# EAGLE design GunMainBoard (EAGLE 8.6.0)
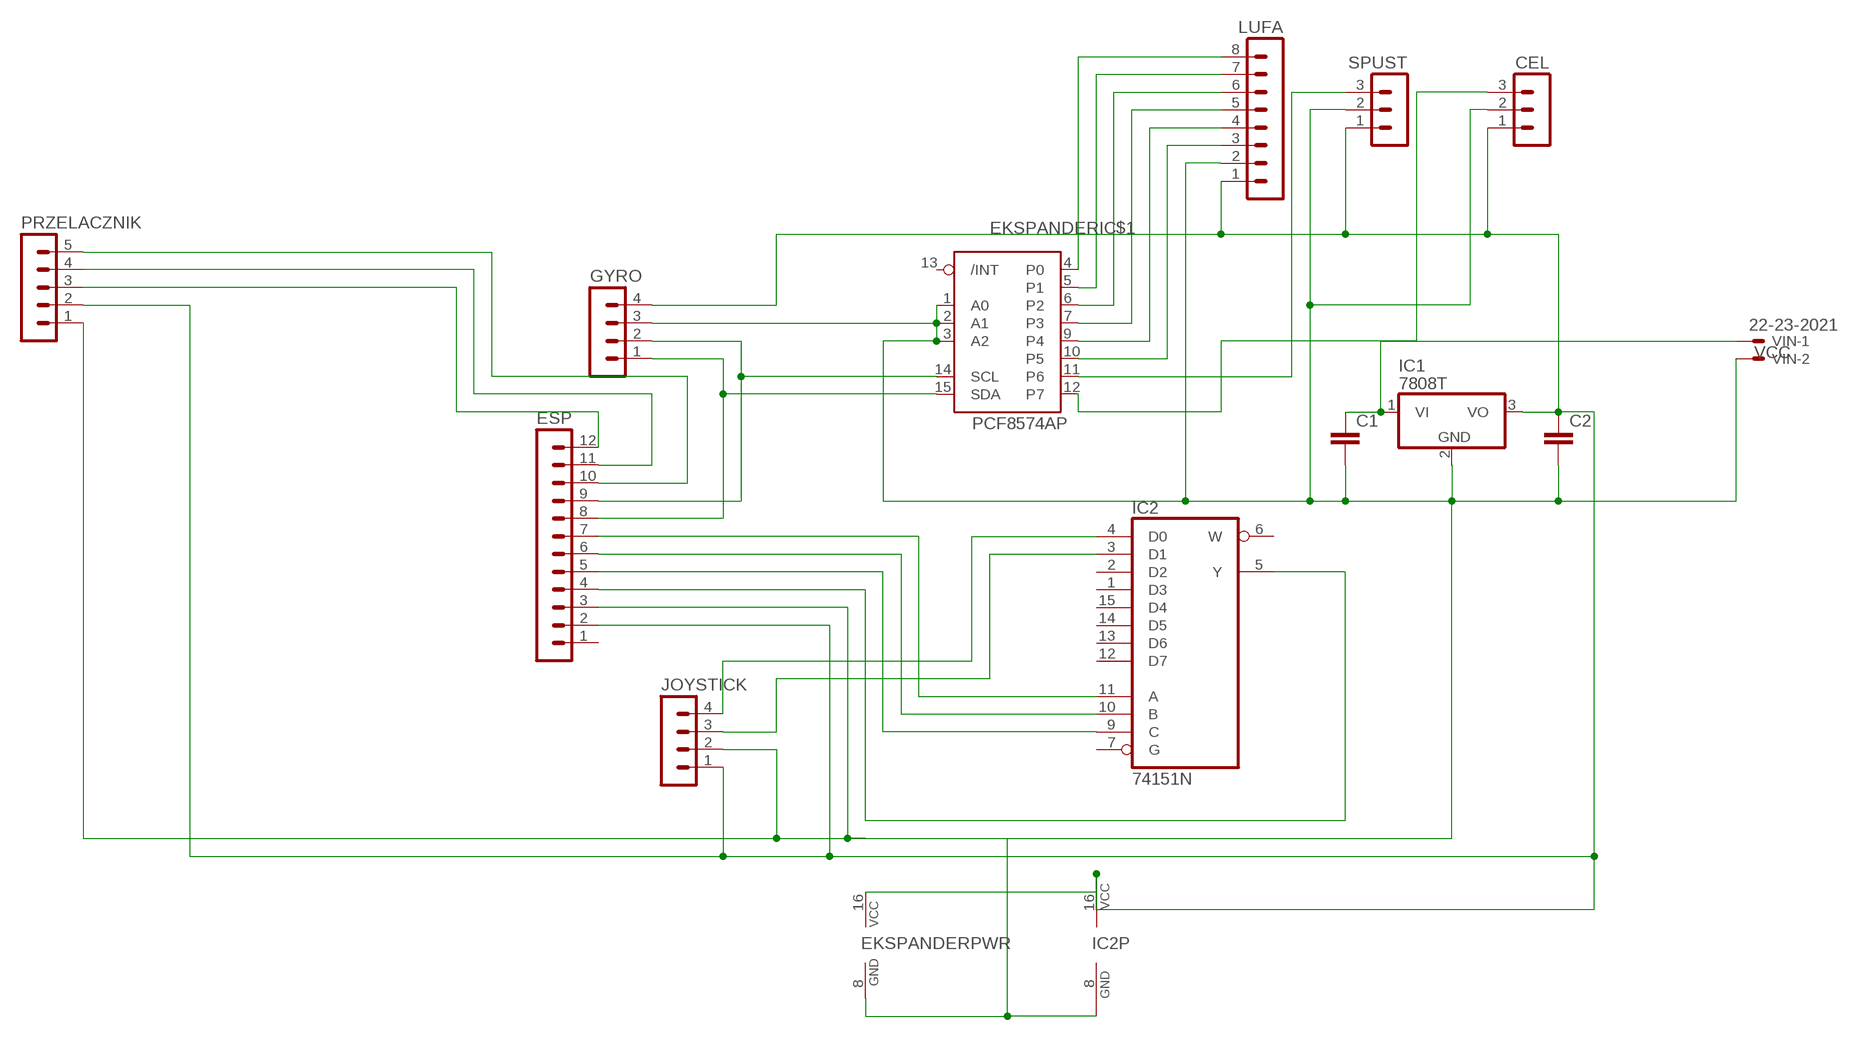
[diagram p0: schematic, sheet 1]

## Parts
C1  C-EU025-024X044  [C025-024X044]
C2  C-EU025-024X044  [C025-024X044]
CEL  MA03-1  [MA03-1]
EKSPANDER  PCF8574AP  [DIL16]
ESP  MA12-1  [MA12-1]
GYRO  MA04-1  [MA04-1]
IC1  7808T  [TO220H]
IC2  74151N  [DIL16]
JOYSTICK  MA04-1  [MA04-1]
LUFA  MA08-1  [MA08-1]
PRZELACZNIK  MA05-1  [MA05-1]
SPUST  MA03-1  [MA03-1]
VIN  22-23-2021  [22-23-2021]

## Nets
N$1: ESP.10 PRZELACZNIK.5
N$3: EKSPANDER.15(IC$1:SDA) ESP.8 GYRO.1
N$4: EKSPANDER.4(IC$1:P0) LUFA.8
N$5: ESP.7 IC2.11(A)
N$6: EKSPANDER.14(IC$1:SCL) ESP.9 GYRO.2
N$7: ESP.6 IC2.10(B)
N$8: ESP.5 IC2.9(C)
N$9: ESP.4 IC2.5(Y)
N$10: C1.2 C2.2 CEL.2 EKSPANDER.1(IC$1:A0) EKSPANDER.2(IC$1:A1) EKSPANDER.3(IC$1:A2) EKSPANDER.8(PWR:GND) ESP.3 GYRO.3 IC1.2(GND) IC2.8(GND) JOYSTICK.2 LUFA.2 PRZELACZNIK.1 SPUST.2 VIN.2
N$11: EKSPANDER.5(IC$1:P1) LUFA.7
N$12: EKSPANDER.6(IC$1:P2) LUFA.6
N$13: EKSPANDER.7(IC$1:P3) LUFA.5
N$14: EKSPANDER.9(IC$1:P4) LUFA.4
N$15: EKSPANDER.10(IC$1:P5) LUFA.3
N$16: EKSPANDER.11(IC$1:P6) SPUST.3
N$17: C1.1 IC1.1(VI) VIN.1
N$18: IC2.3(D1) JOYSTICK.3
N$19: CEL.3 EKSPANDER.12(IC$1:P7)
N$20: IC2.4(D0) JOYSTICK.4
N$21: ESP.11 PRZELACZNIK.4
N$22: ESP.12 PRZELACZNIK.3
N$25: C2.1 CEL.1 EKSPANDER.16(PWR:VCC) ESP.2 GYRO.4 IC1.3(VO) IC2.16(VCC) JOYSTICK.1 LUFA.1 PRZELACZNIK.2 SPUST.1
Unconnected: EKSPANDER.13(IC$1:/INT) ESP.1 IC2.1(D3) IC2.2(D2) IC2.6(W) IC2.7(G) IC2.12(D7) IC2.13(D6) IC2.14(D5) IC2.15(D4)

## Library data of the parts
C1 C2 = rcl:C-EU: CAPACITOR, European symbol; SPICEPREFIX: C
CEL SPUST = con-lstb:MA03-1: PIN HEADER; OC_FARNELL: unknown; OC_NEWARK: unknown
EKSPANDER = i2c:PCF8574: Remote 8-Bit I/O Expander for I²C Bus
ESP = con-lstb:MA12-1: PIN HEADER; OC_FARNELL: unknown; OC_NEWARK: unknown
GYRO JOYSTICK = con-lstb:MA04-1: PIN HEADER; OC_FARNELL: unknown; OC_NEWARK: unknown
IC1 = linear:78*: Positive VOLTAGE REGULATOR Source: http://cache.national.com/ds/LM/LM78L05.pdf http://www.fairchildsemi.com/ds/LM/LM7805.pdf
IC2 = 74xx-us:74*151: Data SELECTOR/MULTIPLEXER
LUFA = con-lstb:MA08-1: PIN HEADER; OC_FARNELL: unknown; OC_NEWARK: unknown
PRZELACZNIK = con-lstb:MA05-1: PIN HEADER; OC_FARNELL: unknown; OC_NEWARK: unknown
VIN = con-molex:22-23-2021: .100" (2.54mm) Center Header - 2 Pin; MF: MOLEX; MPN: 22-23-2021; OC_FARNELL: 1462926; OC_NEWARK: 25C3832

## Board
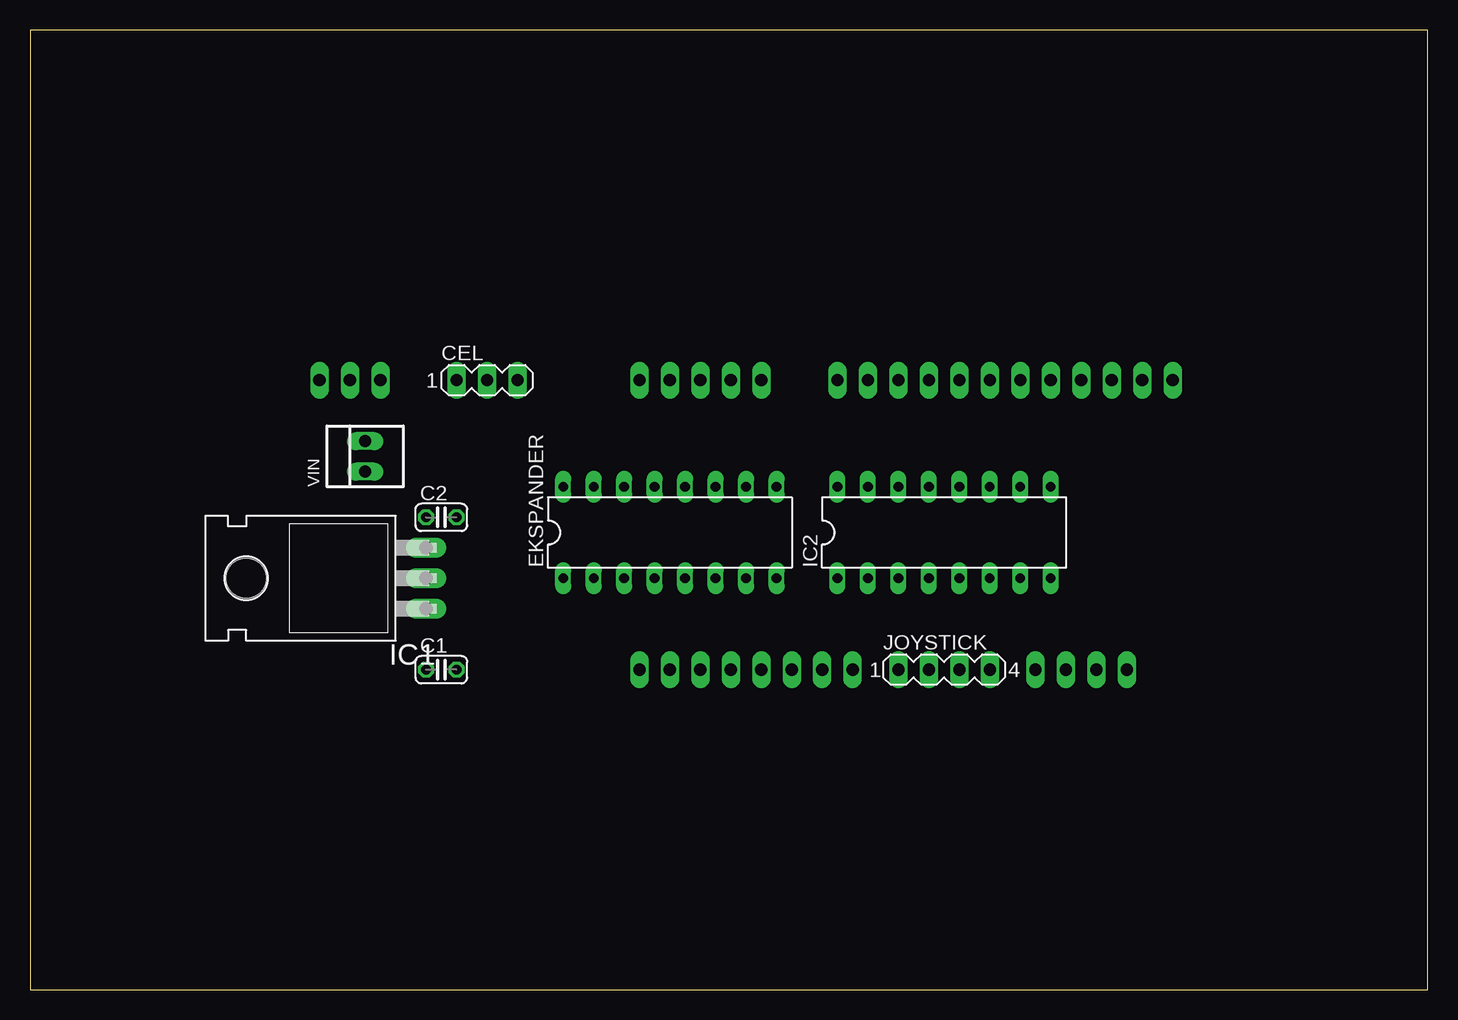
[diagram p1: board, top side]
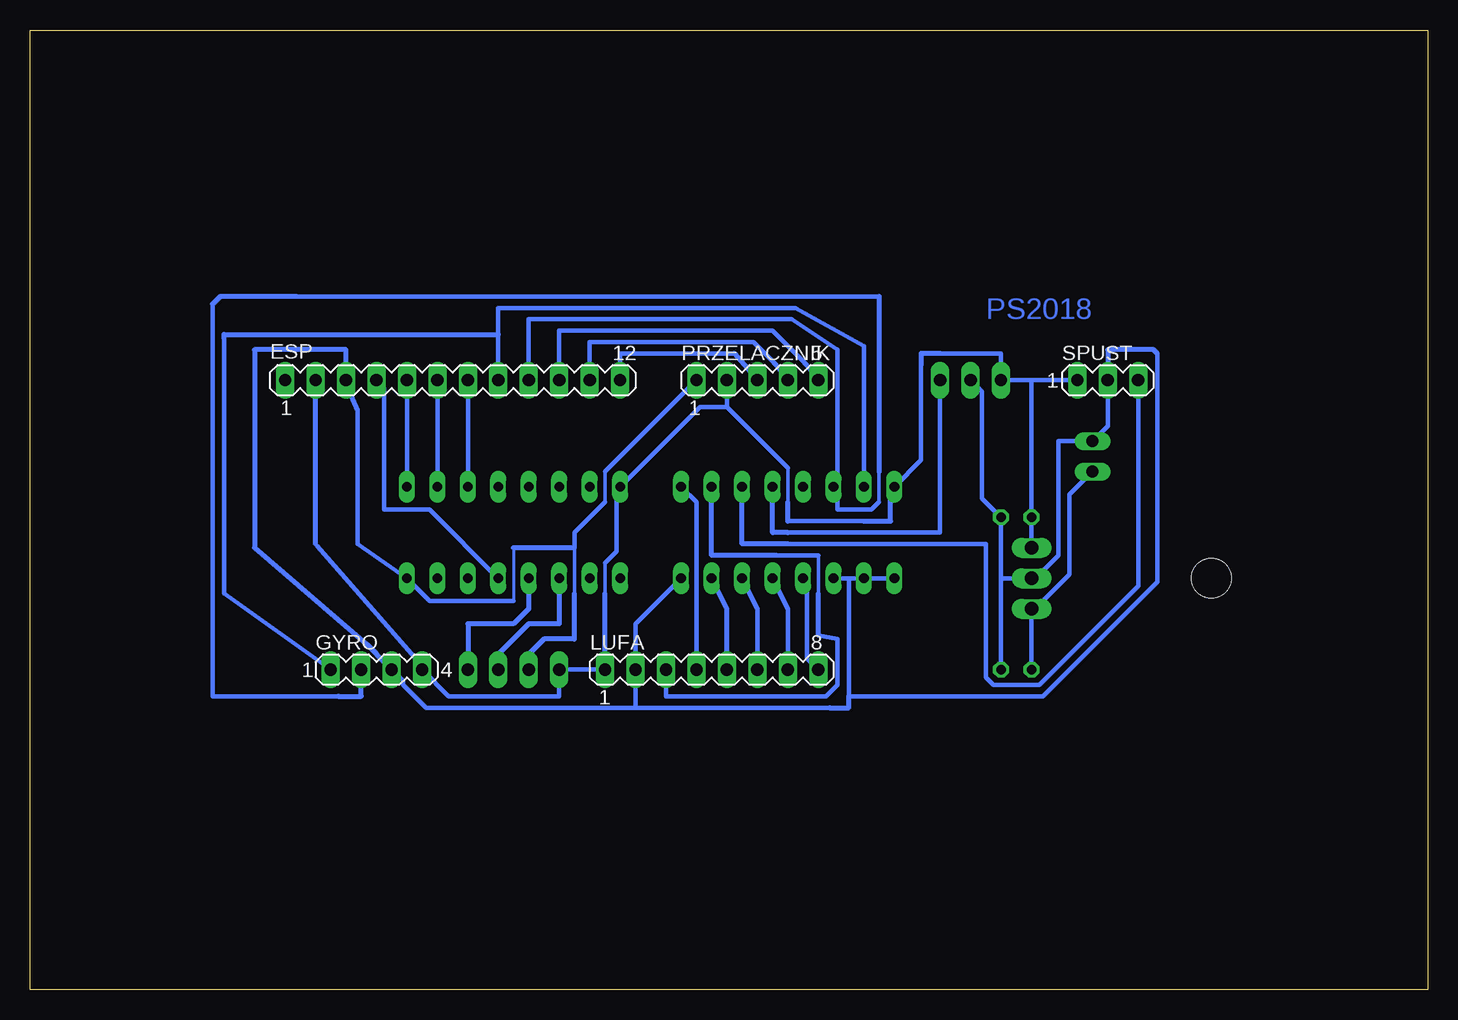
[diagram p2: board, bottom side, seen from below]

Size 116.51 x 80 mm. Coordinates in mm from the lower left corner, seen from the top.
Outline: 0,0 116.51,0 116.51,80 0,80 0,0
Copper layers (1*16): Top 0.035mm / dielectric 1.5mm / Bottom 0.035mm
Design rules "default *": minimum track width 15mil, minimum drill 0.35mm, track to track 16mil, track to pad 13mil, pad to pad 10mil, via to via 6mil, smd to smd 6mil, copper to edge 40mil, drill to drill 6mil, minimum pad ring 10mil, minimum via ring 8mil, stop-mask expansion 4mil, vias tented up to drill 0mil, thermal gap 10mil

### Footprints (pad centres in the part's own frame; a part is rotated, then mirrored left to right if it is on the bottom)
C025-024X044 = drill 0.813 octagon: 1 -1.27,0; 2 1.27,0
MA03-1 = drill 1.016 long: 1 -2.54,0; 2 0,0; 3 2.54,0
DIL16 = drill 0.813 long: 1 -8.89,-3.81; 2 -6.35,-3.81; 3 -3.81,-3.81; 4 -1.27,-3.81; 5 1.27,-3.81; 6 3.81,-3.81; 7 6.35,-3.81; 8 8.89,-3.81; 9 8.89,3.81; 10 6.35,3.81; 11 3.81,3.81; 12 1.27,3.81; 13 -1.27,3.81; 14 -3.81,3.81; 15 -6.35,3.81; 16 -8.89,3.81
MA12-1 = drill 1.016 long: 1 -13.97,0; 2 -11.43,0; 3 -8.89,0; 4 -6.35,0; 5 -3.81,0; 6 -1.27,0; 7 1.27,0; 8 3.81,0; 9 6.35,0; 10 8.89,0; 11 11.43,0; 12 13.97,0
MA04-1 = drill 1.016 long: 1 -3.81,0; 2 -1.27,0; 3 1.27,0; 4 3.81,0
TO220H = drill 1.118 long: 1 -2.54,-10.16; 2 0,-10.16; 3 2.54,-10.16 | hole 3.302: 0,4.826
MA08-1 = drill 1.016 long: 1 -8.89,0; 2 -6.35,0; 3 -3.81,0; 4 -1.27,0; 5 1.27,0; 6 3.81,0; 7 6.35,0; 8 8.89,0
MA05-1 = drill 1.016 long: 1 -5.08,0; 2 -2.54,0; 3 0,0; 4 2.54,0; 5 5.08,0
22-23-2021 = drill 1 long: 1 -1.27,0; 2 1.27,0

### Placement (x,y rotation side)
C1  34.29,26.67 0 top
C2  34.29,39.37 0 top
CEL  38.1,50.8 0 top
EKSPANDER  53.34,38.1 0 top
ESP  81.28,50.8 0 bottom
GYRO  87.63,26.67 0 bottom
IC1  22.86,34.29 90 top
IC2  76.2,38.1 0 top
JOYSTICK  76.2,26.67 0 top
LUFA  59.69,26.67 0 bottom
PRZELACZNIK  55.88,50.8 0 bottom
SPUST  26.67,50.8 0 bottom
VIN  27.94,44.45 90 top

### Tracks (layer width: path | path; a pad name or v marks a point on that pad's centre or on a via)
N$1
  Bottom 0.381: 51.75,52.07 51.91,52.23 54.61,54.93 72.39,54.93 ESP.10
  Bottom 0.406: 51.91,52.23 PRZELACZNIK.5
N$3
  Bottom 0.381: EKSPANDER.15 46.99,53.66 52.7,56.83 77.47,56.83 77.47,54.61 ESP.8 | GYRO.1 100.33,33.02 100.33,54.29
  Bottom 0.406: 100.33,54.29 100.33,54.61 77.47,54.61
N$4
  Bottom 0.381: EKSPANDER.4 51.75,33.97 51.75,27.62 LUFA.8
N$5
  Bottom 0.381: ESP.7 IC2.11
N$6
  Bottom 0.305: 45.72,43.18 45.72,40.64
  Bottom 0.381: 49.21,42.23 49.21,53.34 53.02,55.88 74.93,55.88 ESP.9 | 90.81,24.45 101.28,24.45 101.28,57.15 | 94.3,57.78 45.72,57.78 | 45.72,40.64 46.35,40.01 49.21,40.01 49.21,42.23 | 49.21,42.23 EKSPANDER.14
  Bottom 0.406: 94.3,57.78 100.65,57.78 101.28,57.15 | 45.72,57.78 45.72,43.18 | 90.81,24.45 88.9,24.45 GYRO.2
N$7
  Bottom 0.381: ESP.6 IC2.10
N$8
  Bottom 0.381: ESP.5 IC2.9
N$9
  Bottom 0.381: IC2.5 83.19,40.01 87,40.01 87,50.16 ESP.4
N$10
  Bottom 0.254: 76.2,36.83 76.2,32.38
  Bottom 0.305: 68.58,40.64 68.58,43.18 | 71.12,33.02 71.12,36.83
  Bottom 0.381: ESP.3 90.17,50.48 89.22,48.26 89.22,37.15 IC2.8 83.19,32.38 76.2,32.38 | 71.12,36.83 71.12,38.1 68.58,40.64 | 68.58,43.18 PRZELACZNIK.1 | SPUST.2 26.67,46.99 VIN.2 30.8,45.72 30.8,36.2 32.7,34.29 IC1.2 35.56,34.29 | 35.56,34.29 C2.2 37.15,40.96 37.15,49.85 CEL.2 | 35.56,34.29 C1.2 | EKSPANDER.1 EKSPANDER.2 48.26,34.29 | 48.26,34.29 EKSPANDER.3 | EKSPANDER.8 66.04,30.48 LUFA.2 66.04,23.5 | 66.04,23.5 83.5,23.5 85.41,25.4 85.41,25.72 GYRO.3 86.36,26.99 | 48.26,34.29 48.26,24.45 32.07,24.45 22.54,33.97 22.54,53.02 | 66.04,23.5 49.85,23.5
  Bottom 0.406: 71.12,33.02 71.12,29.21 73.66,29.21 74.93,27.94 JOYSTICK.2 | 71.12,36.83 76.2,36.83 | GYRO.3 87.61,27.91 87.61,27.97 88.36,28.73 88.42,28.73 97.79,36.83 97.79,53.34 90.17,53.34 ESP.3 | SPUST.2 26.67,53.34 22.86,53.34 22.54,53.02 | 49.85,23.5 48.26,23.5 48.26,24.45
N$11
  Bottom 0.381: EKSPANDER.5 53.34,31.75 LUFA.7
N$12
  Bottom 0.381: EKSPANDER.6 55.88,31.75 LUFA.6
N$13
  Bottom 0.406: LUFA.5 58.42,31.75 EKSPANDER.7
N$14
  Bottom 0.381: EKSPANDER.9 60.96,40.64 LUFA.4
N$15
  Bottom 0.305: 50.8,33.02 50.8,36.2
  Bottom 0.381: 54.29,36.2 50.8,36.2 | 50.8,29.53 49.21,29.21 49.21,25.4 50.16,24.45 63.5,24.45 LUFA.3
  Bottom 0.406: 54.29,36.2 59.69,36.2 EKSPANDER.10 | 50.8,29.53 50.8,33.02
N$16
  Bottom 0.381: 53.98,37.15 53.34,37.15 36.83,37.15 36.83,26.04 36.2,25.4 32.38,25.4 24.13,33.66 SPUST.3
  Bottom 0.406: 53.34,37.15 57.15,37.15 EKSPANDER.11
N$17
  Bottom 0.381: 33.02,31.43 C1.1 | VIN.1 29.84,41.27 29.84,34.61 33.02,31.43 | 33.02,31.43 IC1.1
N$18
  Bottom 0.406: IC2.3 72.39,30.48 74.93,30.48 77.47,27.94 JOYSTICK.3
N$19
  Bottom 0.381: 54.29,41.59 EKSPANDER.12 | 53.66,38.1 53.34,38.1 40.64,38.1 CEL.3
  Bottom 0.406: 53.34,38.1 54.61,38.1 EKSPANDER.12
N$20
  Bottom 0.406: IC2.4 74.93,31.75 76.2,30.48 80.01,30.48 JOYSTICK.4
N$21
  Bottom 0.381: 54.29,52.07 54.45,52.23 56.2,53.98 69.85,53.98 ESP.11
  Bottom 0.406: 54.45,52.23 PRZELACZNIK.4
N$22
  Bottom 0.381: 57.78,53.02 67.31,53.02 ESP.12
  Bottom 0.406: 57.78,53.02 PRZELACZNIK.3
N$25
  Bottom 0.305: 53.34,40.64 53.34,43.5 | 68.58,33.02 68.58,35.56
  Bottom 0.381: IC1.3 C2.1 33.02,50.8 | 42.23,52.07 42.23,44.13 EKSPANDER.16 44.77,41.59 | 41.27,53.02 40.64,53.02 35.56,53.02 CEL.1 33.02,50.8 | 33.02,50.8 SPUST.1 | 58.42,48.58 60.64,48.58 IC2.16 67.63,41.59 67.63,36.51 68.58,35.56 | PRZELACZNIK.2 58.42,48.58 | LUFA.1 JOYSTICK.1 72.39,24.45 81.6,24.45 GYRO.4 83.82,26.99 92.55,36.97 92.71,37.15 | 44.77,40.32 44.77,40.64 | 53.34,39.05 46.99,39.05 46.04,39.05 | 53.34,43.5 58.42,48.58
  Bottom 0.406: 92.71,37.15 ESP.2 | 40.64,53.02 42.23,53.02 42.23,52.07 | 46.99,39.05 44.77,39.05 44.77,40.64 44.77,41.59 44.77,41.91 EKSPANDER.16 | 53.34,39.05 53.34,40.64 | LUFA.1 68.58,33.02

### Text on the board
Bottom: PS2018